# Altium project WikiPower.PrjPCB
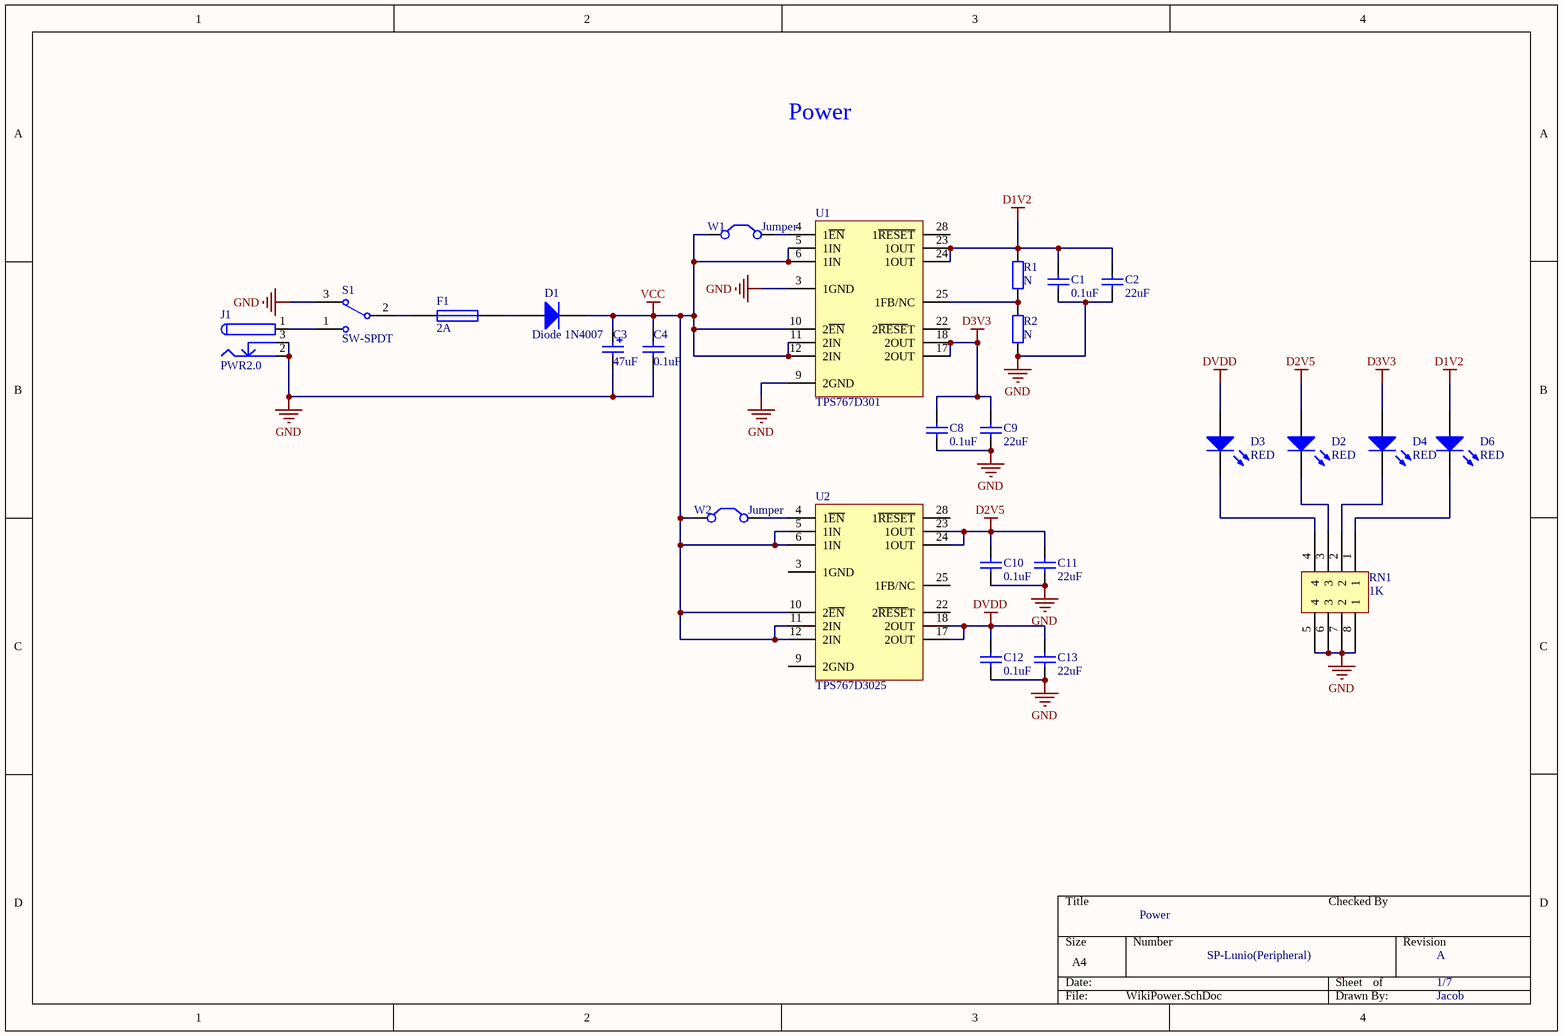
[diagram p0: WikiPower.SchDoc]
1 sheet, 25 parts. Net scope: global (net labels, ports and power ports of the same name join across sheets).
Board file: WikiPower.PcbDoc

## Sheet WikiPower.SchDoc
size A4

### Parts
C1  0.1uF  [0603M]
C2  22uF  [0805M]
C3  47uF  [TAJ-A]
C4  0.1uF  [0603M]
C8  0.1uF  [0603M]
C9  22uF  [0805M]
C10  0.1uF  [0603M]
C11  22uF  [0805M]
C12  0.1uF  [0603M]
C13  22uF  [0805M]
D1  Diode 1N4007  [1210]
D2  RED  [0603pn]
D3  RED  [0603pn]
D4  RED  [0603pn]
D6  RED  [0603pn]
F1  2A  [1210]
J1  PWR2.0  [PWR JACK 2.0MM]
R1  N  [0603M]
R2  N  [0603M]
RN1  1K  [RN1X4/0603]
S1  SW-SPDT  [SK12D07VG3]
U1  TPS767D301  [HTSSOP]
U2  TPS767D3025  [HTSSOP]
W1  Jumper  [HDR1X2/2.00MM]
W2  Jumper  [HDR1X2/2.00MM]

### Nets
D1V2: C1.2 C2.2 D6.1(A) R1.2 U1.23(1OUT) U1.24(1OUT)
D2V5: C10.2 C11.2 D2.1(A) U2.23(1OUT) U2.24(1OUT)
D3V3: C8.2 C9.2 D4.1(A) U1.17(2OUT) U1.18(2OUT)
DVDD: C12.2 C13.2 D3.1(A) U2.17(2OUT) U2.18(2OUT)
GND: C1.1 C2.1 C3.2 C4.1 C8.1 C9.1 C10.1 C11.1 C12.1 C13.1 J1.2 J1.3 R2.1 RN1.5(4) RN1.6(3) RN1.7(2) RN1.8(1) S1.3 U1.3(1GND) U1.9(2GND)
VCC: C3.1 C4.2 D1.2(K) U1.5(1IN) U1.6(1IN) U1.10(2~{EN}) U1.11(2IN) U1.12(2IN) U2.5(1IN) U2.6(1IN) U2.10(2~{EN}) U2.11(2IN) U2.12(2IN) W1.1(C1) W2.1(C1)
NetD1_1: D1.1(A) F1.2
NetD2_2: D2.2(K) RN1.3
NetD3_2: D3.2(K) RN1.4
NetD4_2: D4.2(K) RN1.2
NetD6_2: D6.2(K) RN1.1
NetF1_1: F1.1 S1.2
NetJ1_1: J1.1 S1.1
NetR1_1: R1.1 R2.2 U1.25(1FB/NC)
NetU1_4: U1.4(1~{EN}) W1.2(C2)
NetU2_4: U2.4(1~{EN}) W2.2(C2)

Not connected (* = marked no-connect by the designer): U1 22(2~{RESE}T) 28(1~{RESET}); U2 3(1GND) 9(2GND) 22(2~{RESE}T) 25(1FB/NC) 28(1~{RESET})

### Notes on the sheet
- Power
- Checked By
- SP-Lunio(Peripheral)
- A
- 1/7
- Jacob

### Library data of the parts
C1 C2 C4 C8-C13 = Cap: Capacitor; Published: 8-Jun-2000; LatestRevisionDate: 17-Jul-2002; LatestRevisionNote: Re-released for DXP Platform.; PackageReference: RAD-0.3; Publisher: Altium Limited
  C1 C4 C8 C10 C12: Value: 0.1uF
  C2 C9 C11 C13: Value: 22uF
C3 = Cap Pol1: Polarized Capacitor (Radial); Published: 8-Jun-2000; LatestRevisionDate: 17-Jul-2002; LatestRevisionNote: Re-released for DXP Platform.; PackageReference: RB7.6-15; Publisher: Altium Limited; Value: 47uF
D1 = Diode 1N4007: 1 Amp General Purpose Rectifier; Published: 8-Jun-2000; LatestRevisionDate: 17-Jul-2002; LatestRevisionNote: Re-released for DXP Platform.; DatasheetVersion: 1998; PackageVersion: Aug-1999; PackageReference: DO-41; Publisher: Altium Limited; PackageDescription: Diode, Axial; Body 5.2 x 2.7 mm (LxDia. max), Lead Dia. 0.86 mm (max); Code_JEDEC: DO-204-AL; ComponentLink1Description: Manufacturer Link; ComponentLink1URL: http://www.fairchildsemi.com/; ComponentLink2Description: Datasheet; ComponentLink2URL: http://www.fairchildsemi.com/ds/1N%2F1N4001.pdf
D2-D4 D6 = LED0: Typical INFRARED GaAs LED; Published: 8-Jun-2000; LatestRevisionDate: 08-Jul-2005; LatestRevisionNote: Mech Layer 1 removed.; PackageReference: LED-0; Publisher: Altium Limited
F1 = Fuse 1: Fuse; Published: 8-Jun-2000; LatestRevisionDate: 17-Jul-2002; LatestRevisionNote: Re-released for DXP Platform.; PackageReference: PIN-W2/E2.8; Publisher: Altium Limited; PackageDescription: Thru-Hole; 2 Leads
J1 = PWR2.5: Low Voltage Power Supply Connector; Published: 17-Dec-2003; DatasheetDocument: 09-May-2002; Publisher: Altium Limited; ComponentLink1Description: Manufacturer Link; ComponentLink1URL: http://domino.kycon.com/internet/Products.html
R1 R2 = Res2: Resistor; Published: 8-Jun-2000; LatestRevisionDate: 17-Jul-2002; LatestRevisionNote: Re-released for DXP Platform.; PackageReference: AXIAL-0.4; Publisher: Altium Limited; Value: N
RN1 = Res Pack 2X4: Value: 1K
S1 = SW-SPDT: SPDT Subminiature Toggle Switch, Right Angle Mounting, Vertical Actuation; Published: 24-Mar-1999; LatestRevisionDate: 17-Dec-2003; LatestRevisionNote: Schematic revised, PCB Footprint replaced.; DatasheetVersion: 05-Dec-2000; PackageReference: TL36WW15050; Publisher: Altium Limited; PackageDescription: Switch; 4 Leads; ComponentLink1Description: Manufacturer Link; ComponentLink1URL: http://www.apem.com
U1 = TPS757D301: DOUBLE OUTPUT
U2 = TPS757D3XX: DUAL-OUTPUT LOW-DROPOUT VOLTAGE REGULATORS
W1 W2 = Jumper: Jumper Wire; Published: 24-Mar-1999; LatestRevisionDate: 17-Jul-2002; LatestRevisionNote: Re-released for DXP Platform.; PackageReference: RAD-0.2; Publisher: Altium Limited